# Altium schematic sheet nrf51.SchDoc
size A
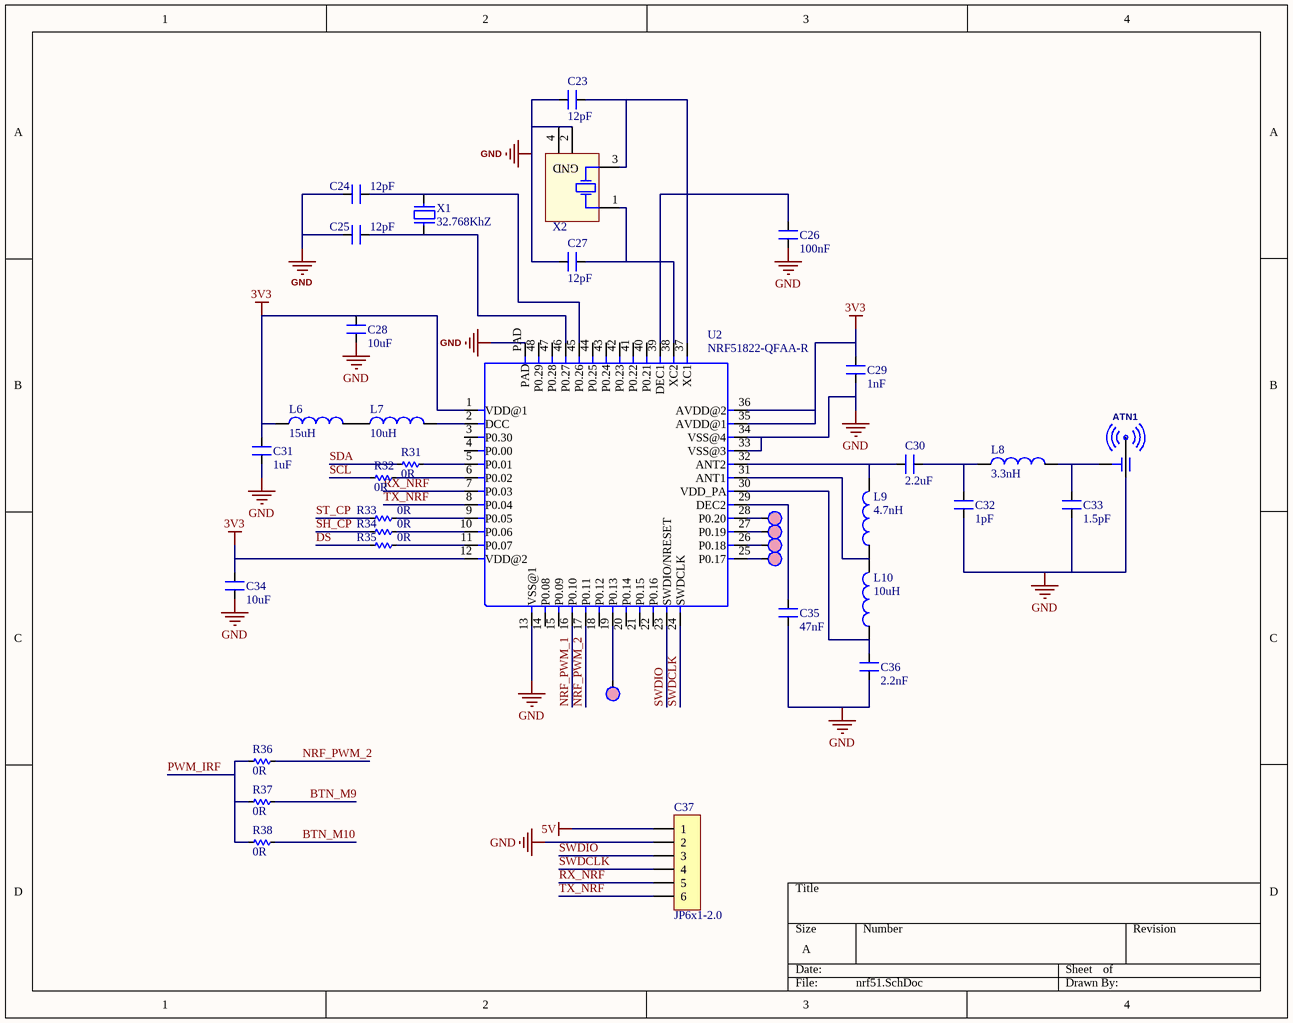
[diagram p0: nrf51.SchDoc]

## Parts
ATN1  P-ANT  [Antenna 2G4]  (value not drawn)
C23  12pF  [CN-SMD-0603]
C24  12pF  [CN-SMD-0603]
C25  12pF  [CN-SMD-0603]
C26  100nF  [CN-SMD-0603]
C27  12pF  [CN-SMD-0603]
C28  10uF  [CN-SMD-0603]
C29  1nF  [CN-SMD-0603]
C30  2.2uF  [CN-SMD-0603]
C31  1uF  [CN-SMD-0603]
C32  1pF  [CN-SMD-0603]
C33  1.5pF  [CN-SMD-0603]
C34  10uF  [CN-SMD-0603]
C35  47nF  [CN-SMD-0603]
C36  2.2nF  [CN-SMD-0603]
C37  JP6x1-2.0  [J6-C1T]
L6  15uH  [INDC1608X95N]
L7  10uH  [INDC1608X95N]
L8  3.3nH  [INDC1608X95N]
L9  4.7nH  [INDC1608X95N]
L10  10uH  [INDC1608X95N]
R31  0R  [RES-SMD-0603]
R32  0R  [RES-SMD-0603]
R33  0R  [RES-SMD-0603]
R34  0R  [RES-SMD-0603]
R35  0R  [RES-SMD-0603]
R36  0R  [RES-SMD-0603]
R37  0R  [RES-SMD-0603]
R38  0R  [RES-SMD-0603]
TP1  TP  [P-TP 1MM]  (value not drawn)  (no BOM)
TP2  TP  [P-TP 1MM]  (value not drawn)  (no BOM)
TP3  TP  [P-TP 1MM]  (value not drawn)  (no BOM)
TP4  TP  [P-TP 1MM]  (value not drawn)  (no BOM)
TP5  TP  [P-TP 1MM]  (value not drawn)  (no BOM)
U2  NRF51822-QFAA-R  [QFN48G-0.4-6X6MM]
X1  32.768KhZ  [XT2-32.768KHz-2_V]
X2  XT4  [XT4-16.000MHz-4_V]  (value not drawn)

## Nets
3V3: C28.1 C29.2 C31.1 C34.1 L6.1 U2.1(VDD@1) U2.12(VDD@2) U2.35(AVDD@1) U2.36(AVDD@2)
5V: C37.1
GND: ATN1.1 C23.1 C24.2 C25.2 C26.2 C27.1 C28.2 C29.1 C31.2 C32.2 C33.2 C34.2 C35.2 C36.2 C37.2 U2.13(VSS@1) U2.33(VSS@3) U2.34(VSS@4) U2.PAD X2.2(GND) X2.4(GND)
BTN_M9: R37.1
BTN_M10: R38.1
DS: R35.1
NRF_PWM_1: U2.16(P0.10)
NRF_PWM_2: R36.1 U2.17(P0.11)
PWM_IRF: R36.2 R37.2 R38.2
RX_NRF: C37.5 U2.7(P0.03)
SCL: R32.2
SDA: R31.2
SH_CP: R34.1
ST_CP: R33.1
SWDCLK: C37.4 U2.24(SWDCLK)
SWDIO: C37.3 U2.23(SWDIO/NRESET)
TX_NRF: C37.6 U2.8(P0.04)
NetATN1_2: ATN1.2 C33.1 L8.2
NetC23_2: C23.2 U2.37(XC1) X2.3(XTAL)
NetC24_1: C24.1 U2.45(P0.26) X1.2
NetC25_1: C25.1 U2.46(P0.27) X1.1
NetC26_1: C26.1 U2.39(DEC1)
NetC27_2: C27.2 U2.38(XC2) X2.1(XTAL)
NetC30_1: C30.1 C32.1 L8.1
NetC30_2: C30.2 L9.2 U2.32(ANT2)
NetC35_1: C35.1 U2.29(DEC2)
NetC36_1: C36.1 L10.1 U2.30(VDD_PA)
NetL6_2: L6.2 L7.1
NetL7_2: L7.2 U2.2(DCC)
NetL9_1: L9.1 L10.2 U2.31(ANT1)
NetR31_1: R31.1 U2.5(P0.01)
NetR32_1: R32.1 U2.6(P0.02)
NetR33_2: R33.2 U2.9(P0.05)
NetR34_2: R34.2 U2.10(P0.06)
NetR35_2: R35.2 U2.11(P0.07)
NetTP1_1: TP1.1 U2.28(P0.20)
NetTP2_1: TP2.1 U2.27(P0.19)
NetTP3_1: TP3.1 U2.26(P0.18)
NetTP4_1: TP4.1 U2.25(P0.17)
NetTP5_1: TP5.1 U2.19(P0.13)

Not connected (* = marked no-connect by the designer): U2 3(P0.30) 4(P0.00) 14(P0.08) 15(P0.09) 18(P0.12) 20(P0.14) 21(P0.15) 22(P0.16) 40(P0.21) 41(P0.22) 42(P0.23) 43(P0.24) 44(P0.25) 47(P0.28) 48(P0.29)

## Library data of the parts
C23-C36 = CN: Tu gom; Value: 33pF
C37 = JP6x1-2.0: WR-PHD 2.00 mm Socket Header; Manufacturer: W¨¹rth Elektronik eiSos GmbH; partNo: 62000611821; ComponentLink1 Description: Manufacturer; ComponentLink2 Description: Datasheet; NoPins: 06; Created Date: 2 April 2013; ComponentLink1URL: http://www.we-online.com; ComponentLink2URL: http://katalog.we-online.de/em/datasheet/6200xx11821.pdf; Created by: Karrer Zheng
L6-L10 = ASMCI-0603-100N-T: Ind Chip Shielded Multi-Layer 10uH 30% 1MHz Ferrite 50mA 0603 T/R; Package: None; Price: None; Value: *; MP: ASMCI-0603-100N-T; Availability: Unavailable
R31-R38 = Res-SMD: Resistor; Manufacturer: Generic Components; Class: Passive; Published: 08/06/2000; Publisher: Altium Hobart Technology Centre
TP1-TP5 = P-TESTPOINT
U2 = NRF51822-QFAA-R: IC RF TxRx + MCU Bluetooth, General ISM > 1GHz Bluetooth v4.0 2.4GHz 48-VFQFN Exposed Pad; MF: Nordic; SnapEDA_Link: https://www.snapeda.com/parts/NRF51822-QFAA-R/Nordic%20Semiconductor%20ASA/view-part/49437/?ref=snap; Availability: Warning; MP: NRF51822-QFAA-R; Value: *; Price: None; Package: VFQFN-48 Nordic; BuyPart: https://www.snapeda.com/parts/NRF51822-QFAA-R/Nordic%20Semiconductor%20ASA/view-part/49437/?ref=eda
X1 = XT2: Crystal, 32.768 KHz, -40 to 85 degC, 3.2 x 1.5 x 0.9 mm SMD; Value: 4Mhz
X2 = XT4: Crystal, 16 MHz, -30 to 85 degC, 3.2 x 2.5 x 0.9 mm SMD; Value: 4Mhz